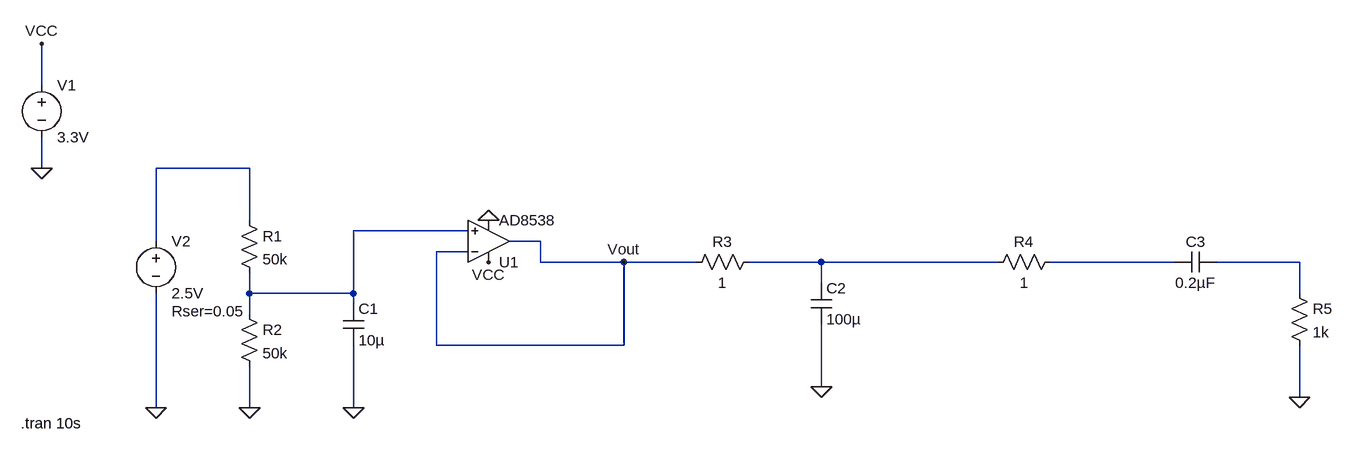
[diagram p0: schematic attenuator-bias.asc]
attenuator-bias.asc, the LTspice schematic file:
Version 4.1
SHEET 1 1672 680
WIRE -320 80 -320 16
WIRE -320 208 -320 160
WIRE 0 208 -144 208
WIRE 0 288 0 208
WIRE 336 304 160 304
WIRE -144 320 -144 208
WIRE 448 320 400 320
WIRE 336 336 288 336
WIRE 448 352 448 320
WIRE 576 352 448 352
WIRE 688 352 576 352
WIRE 880 352 768 352
WIRE 1152 352 880 352
WIRE 1424 352 1232 352
WIRE 1616 352 1488 352
WIRE 880 384 880 352
WIRE 0 400 0 368
WIRE 160 400 160 304
WIRE 160 400 0 400
WIRE 1616 400 1616 352
WIRE 160 416 160 400
WIRE 0 432 0 400
WIRE 288 480 288 336
WIRE 576 480 576 352
WIRE 576 480 288 480
WIRE 880 544 880 448
WIRE 1616 560 1616 480
WIRE -144 576 -144 400
WIRE 0 576 0 512
WIRE 160 576 160 480
FLAG -320 208 0
FLAG -320 16 VCC
FLAG 368 352 VCC
FLAG 368 288 0
FLAG 0 576 0
FLAG 160 576 0
FLAG -144 576 0
FLAG 576 352 Vout
FLAG 880 544 0
FLAG 1616 560 0
SYMBOL voltage -320 64 R0
WINDOW 123 0 0 Left 0
WINDOW 39 0 0 Left 0
SYMATTR InstName V1
SYMATTR Value 3.3V
SYMBOL voltage -144 304 R0
WINDOW 123 0 0 Left 0
WINDOW 39 24 124 Left 2
SYMATTR InstName V2
SYMATTR Value 2.5V
SYMATTR SpiceLine Rser=0.05
SYMBOL res -16 272 R0
SYMATTR InstName R1
SYMATTR Value 50k
SYMBOL res -16 416 R0
SYMATTR InstName R2
SYMATTR Value 50k
SYMBOL cap 144 416 R0
SYMATTR InstName C1
SYMATTR Value 10µ
SYMBOL cap 864 384 R0
SYMATTR InstName C2
SYMATTR Value 100µ
SYMBOL res 784 336 R90
WINDOW 0 0 56 VBottom 2
WINDOW 3 32 56 VTop 2
SYMATTR InstName R3
SYMATTR Value 1
SYMBOL res 1248 336 R90
WINDOW 0 0 56 VBottom 2
WINDOW 3 32 56 VTop 2
SYMATTR InstName R4
SYMATTR Value 1
SYMBOL cap 1488 336 R90
WINDOW 0 0 32 VBottom 2
WINDOW 3 32 32 VTop 2
SYMATTR InstName C3
SYMATTR Value 0.2µF
SYMBOL res 1600 384 R0
SYMATTR InstName R5
SYMATTR Value 1k
SYMBOL OpAmps\\AD8538 368 384 M180
SYMATTR InstName U1
TEXT -352 600 Left 2 !.tran 10s

The netlist it stands for:
* attenuator-bias.asc
V1 VCC 0 3.3V
V2 N001 0 2.5V Rser=0.05
R1 N001 N002 50k
R2 N002 0 50k
C1 N002 0 10µ
C2 N003 0 100µ
R3 N003 Vout 1
R4 N004 N003 1
C3 N005 N004 0.2µF
R5 N005 0 1k
X§U1 N002 Vout VCC 0 Vout AD8538  ; pins In+ In- V+ V- OUT
.tran 10s
.backanno
.end